# EAGLE design megacommand18 (EAGLE 7.3.0)

## Sheet 1 of 5
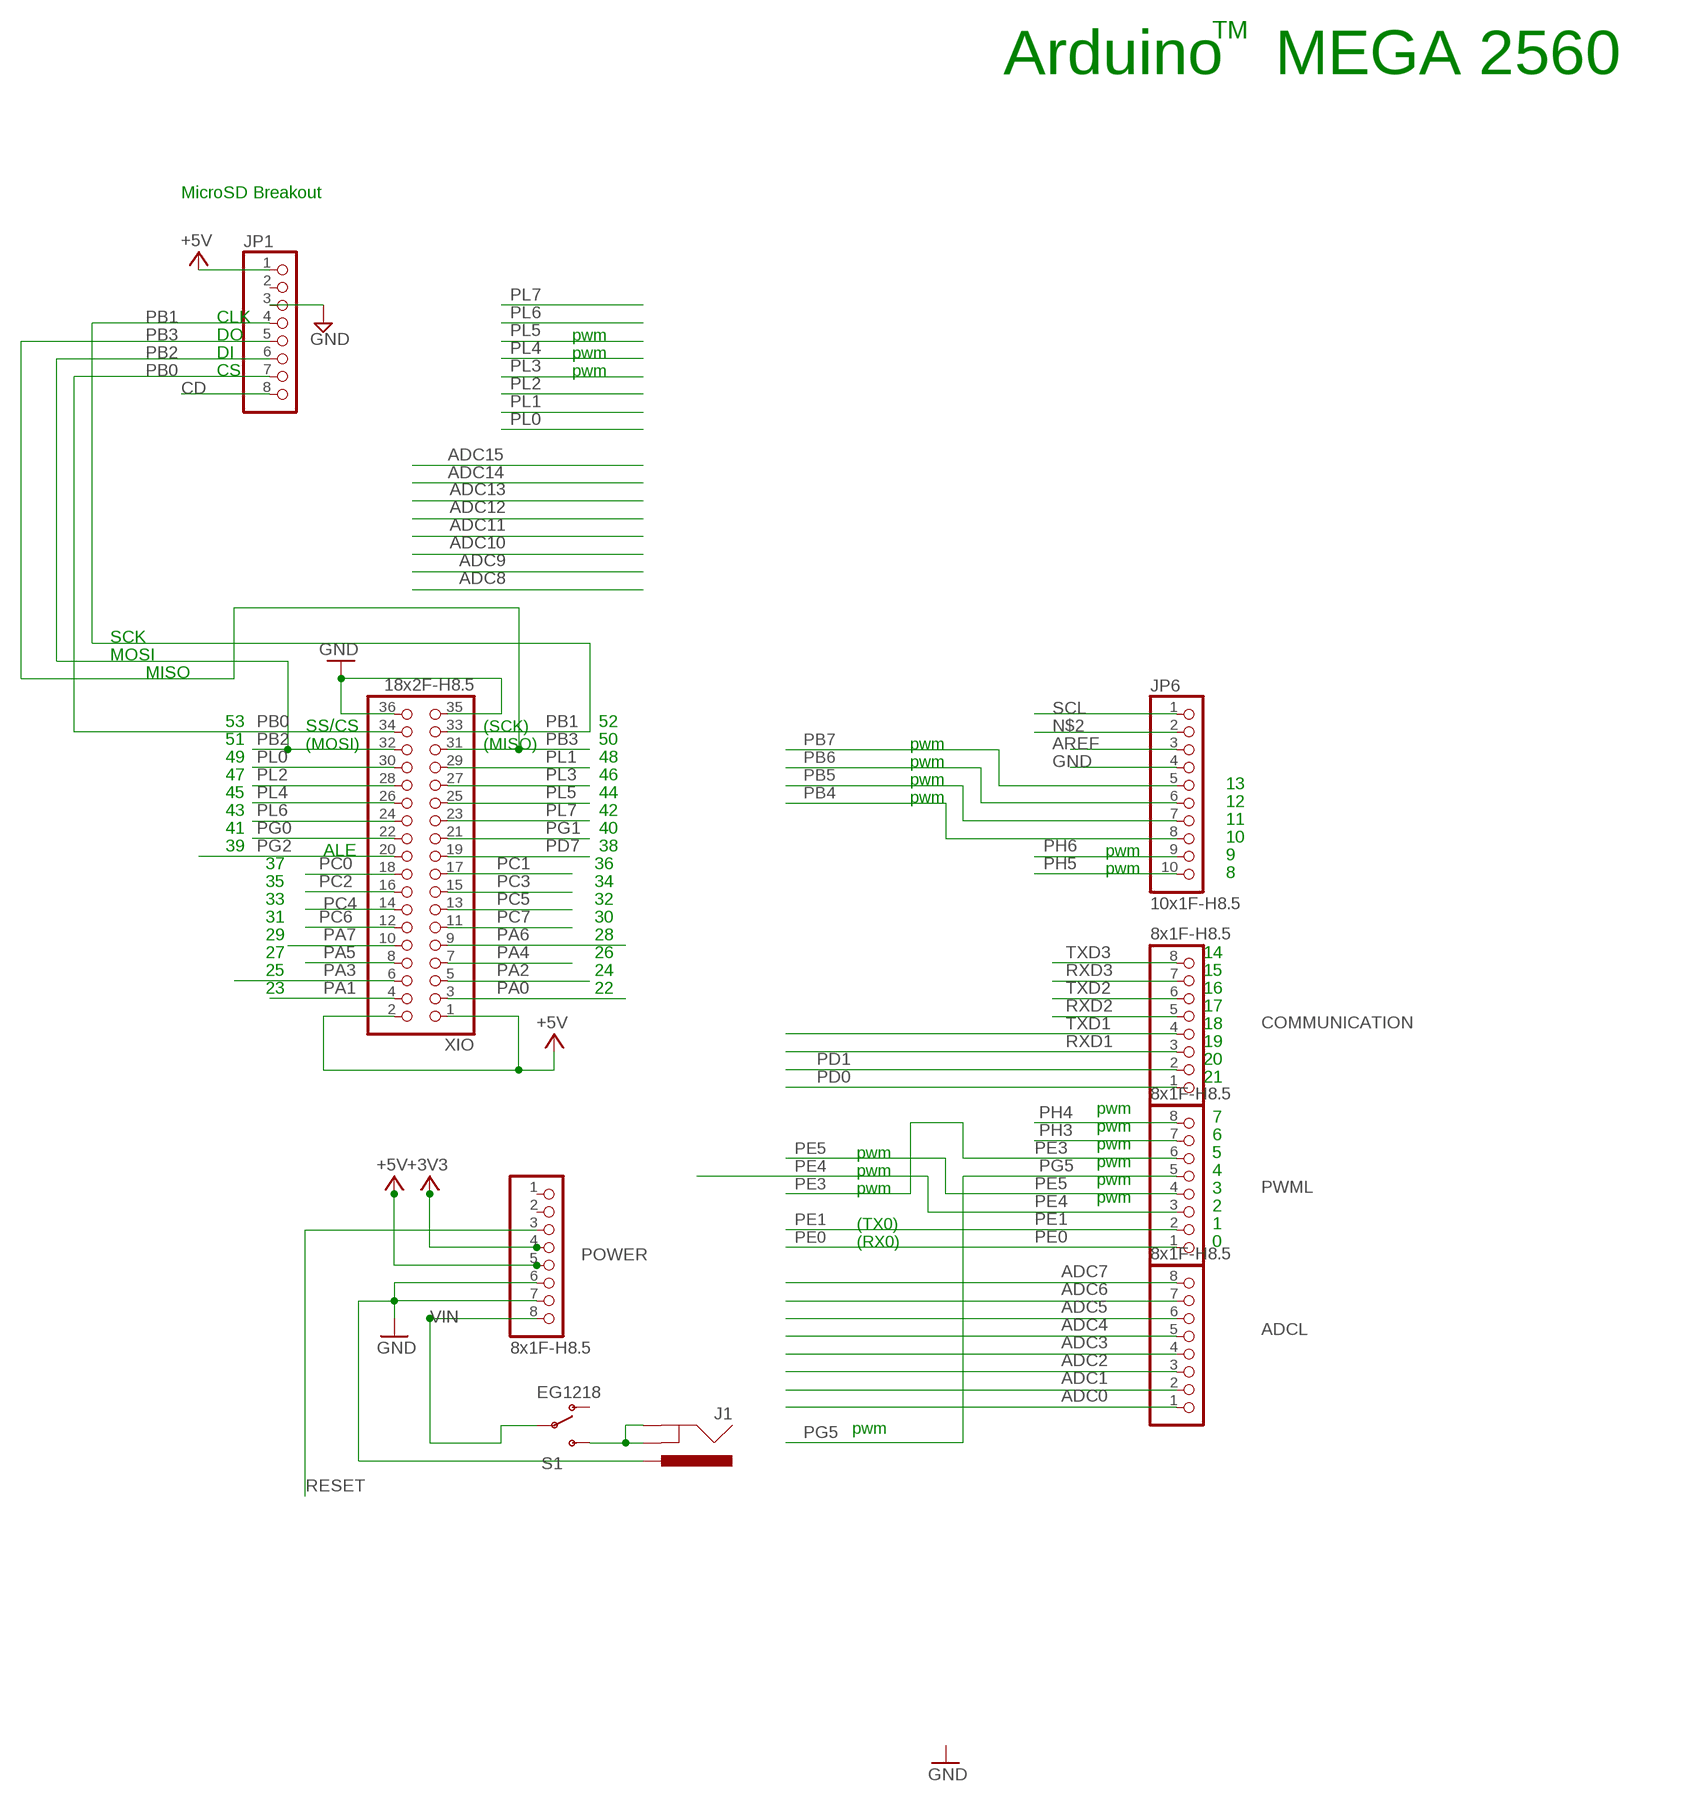
[diagram p0: schematic, sheet 1]

### Parts
ADCL  8x1F-H8.5  PINHD-1X8  [1X08]
COMMUNICATION  8x1F-H8.5  PINHD-1X8  [1X08]
J1  POWER_JACKSLT  [POWER_JACK_SLOT]
JP1  PINHD-1X8BIG  [1X08-BIG]
JP6  10x1F-H8.5  PINHD-1X10_ARD  [1X10]
POWER  8x1F-H8.5  PINHD-1X8  [1X08]
PWML  8x1F-H8.5  PINHD-1X8  [1X08]
S1  EG1218  SWITCH-SPDTKIT  [SWITCH-SPDT_KIT]
XIO  18x2F-H8.5  PINHD-2X18  [2X18]

### Nets
+3V3 [power]: POWER.4
+5V [power usb]: JP1.1 POWER.5 XIO.1 XIO.2 ; also sheet 2,3,4,5
ADC0: ADCL.1 ; also sheet 3
ADC1: ADCL.2 ; also sheet 3
ADC2: ADCL.3 ; also sheet 3
ADC3: ADCL.4 ; also sheet 3
ADC4: ADCL.5
ADC5: ADCL.6
ADC6: ADCL.7
ADC7: ADCL.8
AREF: JP6.3
CD: JP1.8
GND [gnd]: J1.PWR JP1.3 JP6.4 POWER.6 POWER.7 XIO.35 XIO.36 ; also sheet 2,3,4,5
N$2: JP6.2
N$23: J1.GND@1(GNDBREAK) J1.GND@2(GND) S1.3(S)
PA0: XIO.3 ; also sheet 4
PA1: XIO.4 ; also sheet 4
PA2: XIO.5 ; also sheet 4
PA3: XIO.6 ; also sheet 4
PA4: XIO.7 ; also sheet 4
PA5: XIO.8 ; also sheet 4
PA6: XIO.9 ; also sheet 4
PA7: XIO.10 ; also sheet 4
PB0: JP1.7 XIO.34
PB1: JP1.4 XIO.33
PB2: JP1.6 XIO.32
PB3: JP1.5 XIO.31
PB4: JP6.8
PB5: JP6.7
PB6: JP6.6
PB7: JP6.5
PC0: XIO.18 ; also sheet 4
PC1: XIO.17 ; also sheet 4
PC2: XIO.16 ; also sheet 4
PC3: XIO.15 ; also sheet 4
PC4: XIO.14 ; also sheet 4
PC5: XIO.13 ; also sheet 4
PC6: XIO.12 ; also sheet 4
PC7: XIO.11 ; also sheet 4
PD0: COMMUNICATION.1
PD1: COMMUNICATION.2
PD7: XIO.19
PE0: PWML.1
PE1: PWML.2
PE3: PWML.6
PE4: PWML.3 ; also sheet 3
PE5: PWML.4 ; also sheet 3
PG0: XIO.22 ; also sheet 4
PG1: XIO.21 ; also sheet 4
PG2: XIO.20 ; also sheet 4
PG5: PWML.5
PH3: PWML.7
PH4: PWML.8
PH5: JP6.10
PH6: JP6.9
PL0: XIO.30 ; also sheet 2
PL1: XIO.29 ; also sheet 2
PL2: XIO.28 ; also sheet 2
PL3: XIO.27 ; also sheet 3
PL4: XIO.26 ; also sheet 3
PL5: XIO.25
PL6: XIO.24 ; also sheet 4
PL7: XIO.23
RESET: POWER.3
RXD1: COMMUNICATION.3 ; also sheet 5
RXD2: COMMUNICATION.5 ; also sheet 5
RXD3: COMMUNICATION.7
SCL: JP6.1
TXD1: COMMUNICATION.4 ; also sheet 5
TXD2: COMMUNICATION.6 ; also sheet 5
TXD3: COMMUNICATION.8
VIN [power]: POWER.8 S1.2(P)
Unconnected: JP1.2 POWER.1 POWER.2 S1.1(O)

### Notes on the sheet
- TM
- Arduino   MEGA 2560
- MicroSD Breakout
- CLK
- DO | pwm
- DI | pwm
- CS | pwm
- SCK
- MOSI
- MISO
- 53 | SS/CS | (SCK) | 52
- 51 | (MOSI) | (MISO) | 50 | pwm
- 49 | 48 | pwm
- 47 | 46 | pwm
- 13
- 45 | 44 | pwm
- 12
- 43 | 42
- 11
- 41 | 40
- 10
- 39 | ALE | 38 | pwm
- 9
- 37 | 36 | pwm
- 8
- 35 | 34
- 33 | 32
- 31 | 30
- 29 | 28
- 27 | 26 | 14
- 25 | 24 | 15
- 23 | 22 | 16
- 17
- 18
- 19
- 20
- 21
- pwm
- 7
- pwm
- 6
- pwm
- pwm | 5
- pwm
- pwm | 4
- pwm
- pwm | 3
- pwm
- 2
- (TX0) | 1
- (RX0) | 0
- pwm

## Sheet 2 of 5
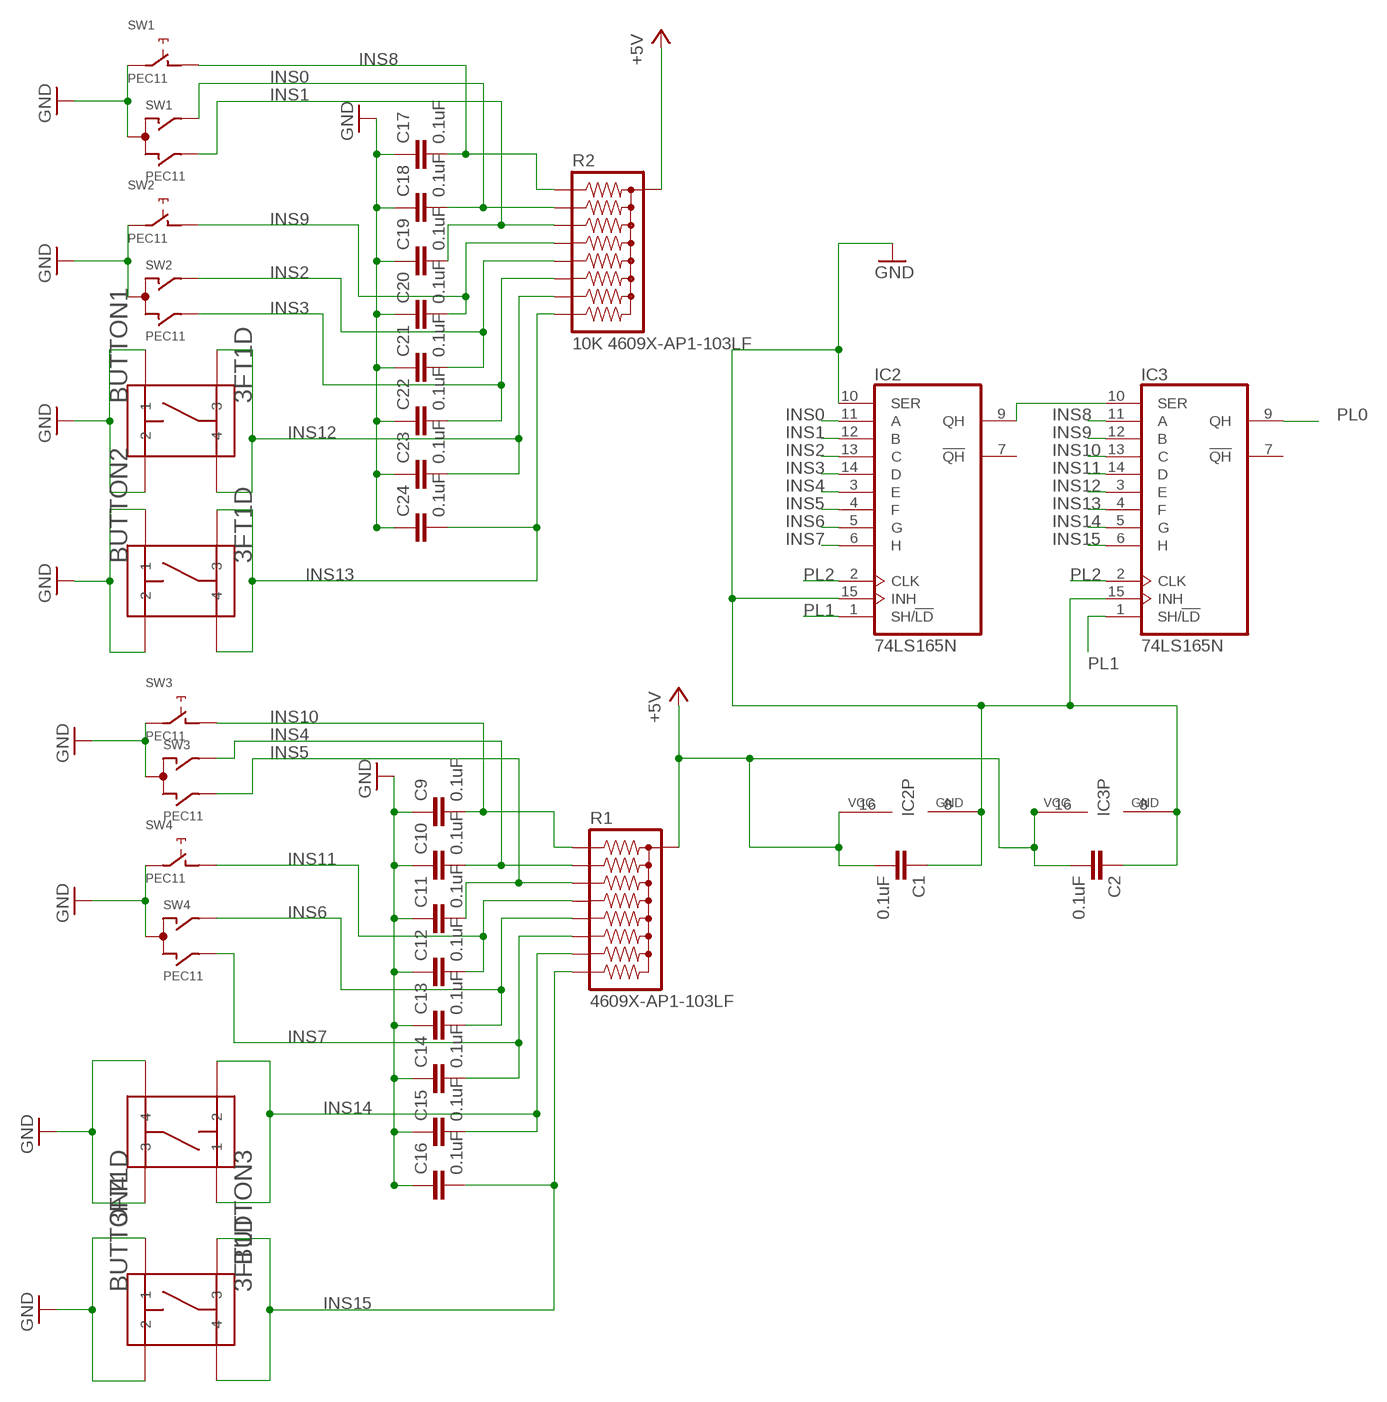
[diagram p1: schematic, sheet 2]

### Parts
BUTTON1  3FT1D  [3FT]
BUTTON2  3FT1D  [3FT]
BUTTON3  3FT1D  [3FT]
BUTTON4  3FT1D  [3FT]
C1  0.1uF  C-EU025-050X050  [C025-050X050]
C2  0.1uF  C-EU025-050X050  [C025-050X050]
C9  0.1uF  C-EU025-050X050  [C025-050X050]
C10  0.1uF  C-EU025-050X050  [C025-050X050]
C11  0.1uF  C-EU025-050X050  [C025-050X050]
C12  0.1uF  C-EU025-050X050  [C025-050X050]
C13  0.1uF  C-EU025-050X050  [C025-050X050]
C14  0.1uF  C-EU025-050X050  [C025-050X050]
C15  0.1uF  C-EU025-050X050  [C025-050X050]
C16  0.1uF  C-EU025-050X050  [C025-050X050]
C17  0.1uF  C-EU025-050X050  [C025-050X050]
C18  0.1uF  C-EU025-050X050  [C025-050X050]
C19  0.1uF  C-EU025-050X050  [C025-050X050]
C20  0.1uF  C-EU025-050X050  [C025-050X050]
C21  0.1uF  C-EU025-050X050  [C025-050X050]
C22  0.1uF  C-EU025-050X050  [C025-050X050]
C23  0.1uF  C-EU025-050X050  [C025-050X050]
C24  0.1uF  C-EU025-050X050  [C025-050X050]
IC2  74LS165N  [DIL16]
IC3  74LS165N  [DIL16]
R1  4609X-AP1-103LF  RPACK-BUSSED-8-SIP-PTH-8  [RPACK-SIP-PTH-8]
R2  10K 4609X-AP1-103LF  RPACK-BUSSED-8-SIP-PTH-8  [RPACK-SIP-PTH-8]
SW1  PEC11  EC12E_SW  [ALPS_EC12E_SW]
SW2  PEC11  EC12E_SW  [ALPS_EC12E_SW]
SW3  PEC11  EC12E_SW  [ALPS_EC12E_SW]
SW4  PEC11  EC12E_SW  [ALPS_EC12E_SW]

### Nets
+5V [power usb]: C1.2 C2.2 IC2.16(VCC) IC3.16(VCC) R1.P$1 R2.P$1 ; also sheet 1,3,4,5
GND [gnd]: BUTTON1.P$1 BUTTON1.P$2 BUTTON2.P$1 BUTTON2.P$2 BUTTON3.P$3 BUTTON3.P$4 BUTTON4.P$1 BUTTON4.P$2 C1.1 C2.1 C9.1 C10.1 C11.1 C12.1 C13.1 C14.1 C15.1 C16.1 C17.1 C18.1 C19.1 C20.1 C21.1 C22.1 C23.1 C24.1 IC2.8(GND) IC2.10(SER) IC2.15(INH) IC3.8(GND) IC3.15(INH) SW1.C SW1.E SW2.C SW2.E SW3.C SW3.E SW4.C SW4.E ; also sheet 1,3,4,5
INS0: C18.2 IC2.11(A) R2.P$3 SW1.A
INS1: C19.2 IC2.12(B) R2.P$4 SW1.B
INS2: C21.2 IC2.13(C) R2.P$6 SW2.A
INS3: C22.2 IC2.14(D) R2.P$7 SW2.B
INS4: C10.2 IC2.3(E) R1.P$3 SW3.A
INS5: C11.2 IC2.4(F) R1.P$4 SW3.B
INS6: C13.2 IC2.5(G) R1.P$6 SW4.A
INS7: C14.2 IC2.6(H) R1.P$7 SW4.B
INS8: C17.2 IC3.11(A) R2.P$2 SW1.D
INS9: C20.2 IC3.12(B) R2.P$5 SW2.D
INS10: C9.2 IC3.13(C) R1.P$2 SW3.D
INS11: C12.2 IC3.14(D) R1.P$5 SW4.D
INS12: BUTTON1.P$3 BUTTON1.P$4 C23.2 IC3.3(E) R2.P$8
INS13: BUTTON2.P$3 BUTTON2.P$4 C24.2 IC3.4(F) R2.P$9
INS14: BUTTON3.P$1 BUTTON3.P$2 C15.2 IC3.5(G) R1.P$8
INS15: BUTTON4.P$3 BUTTON4.P$4 C16.2 IC3.6(H) R1.P$9
N$12: IC2.9(QH) IC3.10(SER)
PL0: IC3.9(QH) ; also sheet 1
PL1: IC2.1(SH/!LD) IC3.1(SH/!LD) ; also sheet 1
PL2: IC2.2(CLK) IC3.2(CLK) ; also sheet 1
Unconnected: IC2.7(!QH) IC3.7(!QH) SW1.GND1(GND1:G) SW1.GND2(GND2:G) SW2.GND1(GND1:G) SW2.GND2(GND2:G) SW3.GND1(GND1:G) SW3.GND2(GND2:G) SW4.GND1(GND1:G) SW4.GND2(GND2:G)

## Sheet 3 of 5
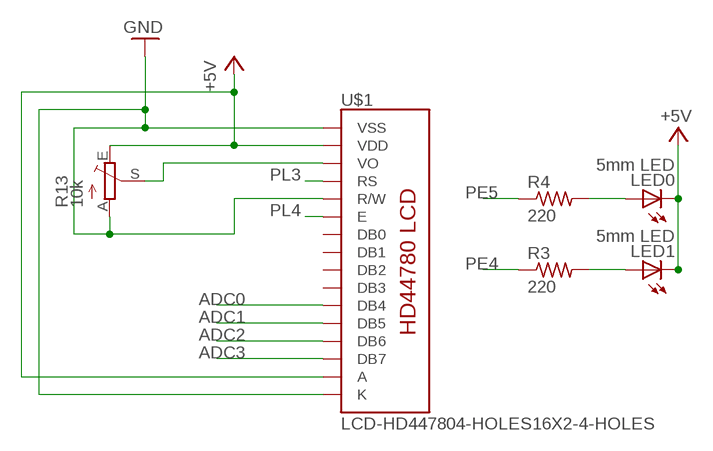
[diagram p2: schematic, sheet 3]

### Parts
LED0  5mm LED  LED_ELD260  [LED_LD260]
LED1  5mm LED  LED_ELD260  [LED_LD260]
R3  220  R-US_0207/7  [0207/7]
R4  220  R-US_0207/7  [0207/7]
R13  10k  TRIM_EU-CA6V  [CA6V]
U$1  LCD-HD447804-HOLES16X2-4-HOLES  [LCD-16X2-4HOLESRGB]

### Nets
+5V [power usb]: LED0.K(C) LED1.K(C) R13.E U$1.2(VDD) U$1.15(A) U$1.18(VDD) U$1.31(A) ; also sheet 1,2,4,5
ADC0: U$1.11(DB4) U$1.27(DB4) ; also sheet 1
ADC1: U$1.12(DB5) U$1.28(DB5) ; also sheet 1
ADC2: U$1.13(DB6) U$1.29(DB6) ; also sheet 1
ADC3: U$1.14(DB7) U$1.30(DB7) ; also sheet 1
GND [gnd]: R13.A U$1.1(VSS) U$1.5(R/W) U$1.16(K) U$1.17(VSS) U$1.21(R/W) U$1.32(K) ; also sheet 1,2,4,5
N$3: LED0.A R4.2
N$13: LED1.A R3.2
N$27: R13.S U$1.3(VO) U$1.19(VO)
PE4: R3.1 ; also sheet 1
PE5: R4.1 ; also sheet 1
PL3: U$1.4(RS) U$1.20(RS) ; also sheet 1
PL4: U$1.6(E) U$1.22(E) ; also sheet 1
Unconnected: U$1.7(DB0) U$1.8(DB1) U$1.9(DB2) U$1.10(DB3) U$1.23(DB0) U$1.24(DB1) U$1.25(DB2) U$1.26(DB3)

## Sheet 4 of 5
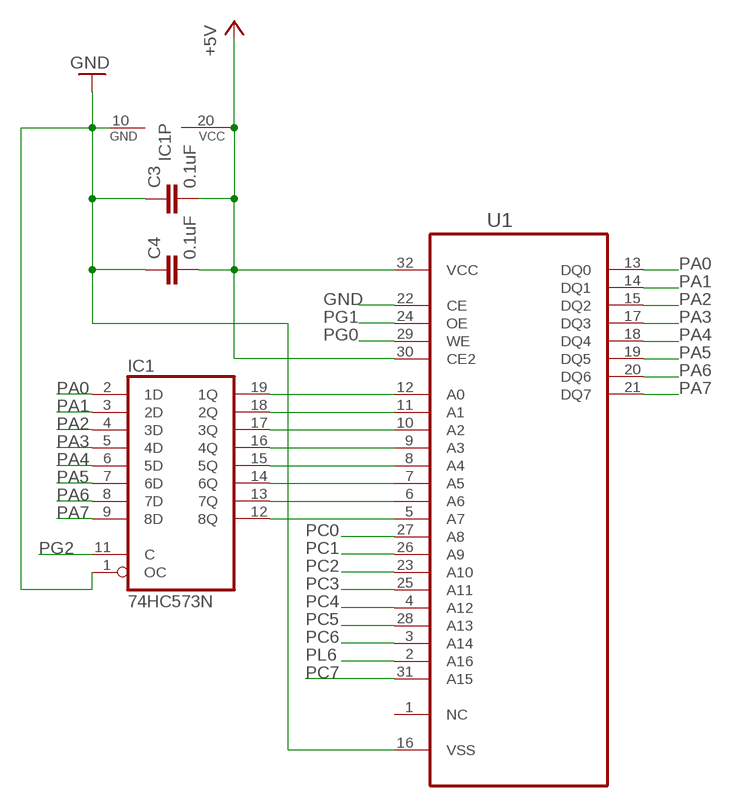
[diagram p3: schematic, sheet 4]

### Parts
C3  0.1uF  C-EU025-050X050  [C025-050X050]
C4  0.1uF  C-EU025-050X050  [C025-050X050]
IC1  74HC573N  [DIL20]
U1  AS6C1008-55PCN  [DIP254P1524X393-32]

### Nets
+5V [power usb]: C3.2 C4.2 IC1.20(VCC) U1.30(CE2) U1.32(VCC) ; also sheet 1,2,3,5
GND [gnd]: C3.1 C4.1 IC1.1(OC) IC1.10(GND) U1.16(VSS) U1.22(CE) ; also sheet 1,2,3,5
N$4: IC1.13(7Q) U1.6(A6)
N$5: IC1.19(1Q) U1.12(A0)
N$6: IC1.18(2Q) U1.11(A1)
N$7: IC1.17(3Q) U1.10(A2)
N$8: IC1.16(4Q) U1.9(A3)
N$9: IC1.15(5Q) U1.8(A4)
N$10: IC1.14(6Q) U1.7(A5)
N$11: IC1.12(8Q) U1.5(A7)
PA0: IC1.2(1D) U1.13(DQ0) ; also sheet 1
PA1: IC1.3(2D) U1.14(DQ1) ; also sheet 1
PA2: IC1.4(3D) U1.15(DQ2) ; also sheet 1
PA3: IC1.5(4D) U1.17(DQ3) ; also sheet 1
PA4: IC1.6(5D) U1.18(DQ4) ; also sheet 1
PA5: IC1.7(6D) U1.19(DQ5) ; also sheet 1
PA6: IC1.8(7D) U1.20(DQ6) ; also sheet 1
PA7: IC1.9(8D) U1.21(DQ7) ; also sheet 1
PC0: U1.27(A8) ; also sheet 1
PC1: U1.26(A9) ; also sheet 1
PC2: U1.23(A10) ; also sheet 1
PC3: U1.25(A11) ; also sheet 1
PC4: U1.4(A12) ; also sheet 1
PC5: U1.28(A13) ; also sheet 1
PC6: U1.3(A14) ; also sheet 1
PC7: U1.31(A15) ; also sheet 1
PG0: U1.29(WE) ; also sheet 1
PG1: U1.24(OE) ; also sheet 1
PG2: IC1.11(C) ; also sheet 1
PL6: U1.2(A16) ; also sheet 1
Unconnected: U1.1(NC)

## Sheet 5 of 5
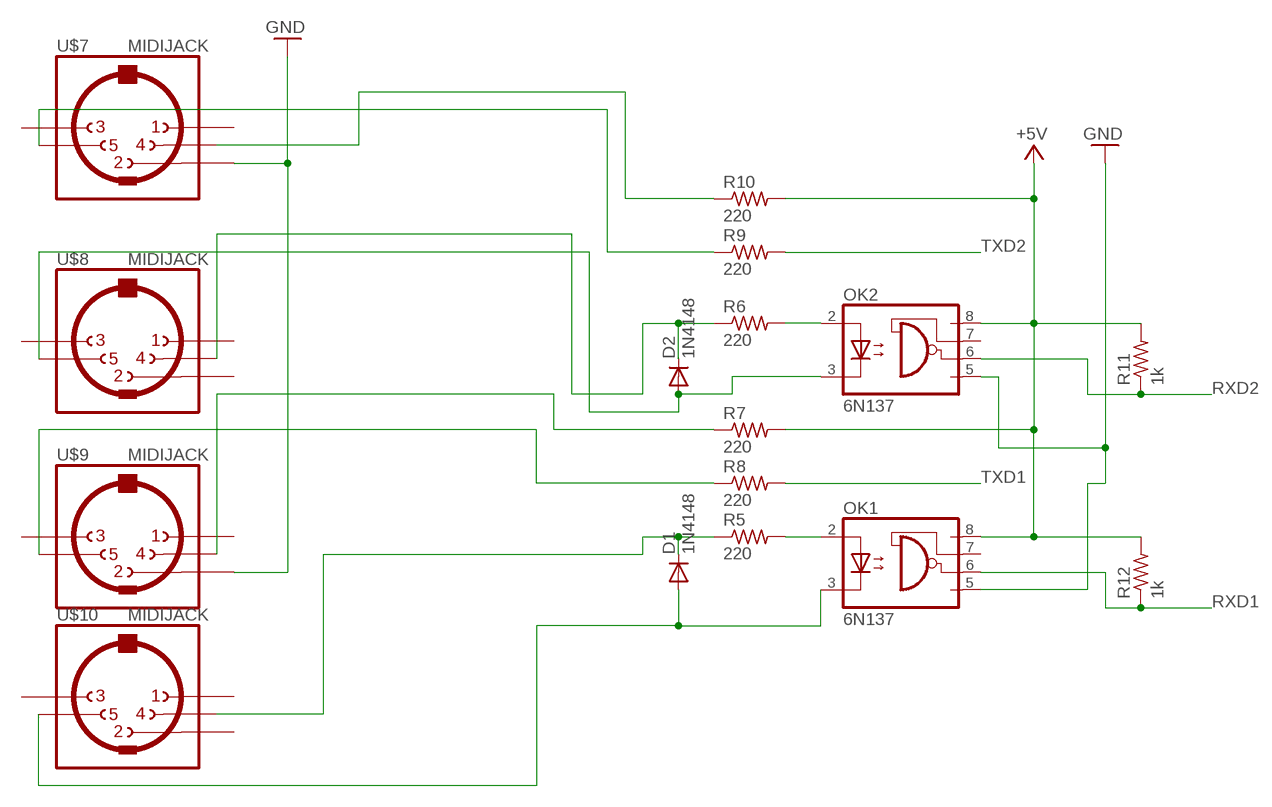
[diagram p4: schematic, sheet 5]

### Parts
D1  1N4148  1N4148DO35-7  [DO35-7]
D2  1N4148  1N4148DO35-7  [DO35-7]
OK1  6N137  [DIL08]
OK2  6N137  [DIL08]
R5  220  R-US_0207/7  [0207/7]
R6  220  R-US_0207/7  [0207/7]
R7  220  R-US_0207/7  [0207/7]
R8  220  R-US_0207/7  [0207/7]
R9  220  R-US_0207/7  [0207/7]
R10  220  R-US_0207/7  [0207/7]
R11  1k  R-US_0207/7  [0207/7]
R12  1k  R-US_0207/7  [0207/7]
U$7  MIDIJACK  [CP-2350]
U$8  MIDIJACK  [CP-2350]
U$9  MIDIJACK  [CP-2350]
U$10  MIDIJACK  [CP-2350]

### Nets
+5V [power usb]: OK1.8(VCC) OK2.8(VCC) R7.2 R10.2 R11.2 R12.2 ; also sheet 1,2,3,4
GND [gnd]: OK1.5(GND) OK2.5(GND) U$7.2 U$9.2 ; also sheet 1,2,3,4
N$1: R8.1 U$9.5
N$14: D1.A OK1.3(C) U$10.5
N$15: D1.C R5.1 U$10.4
N$16: R7.1 U$9.4
N$17: R10.1 U$7.4
N$18: OK2.2(A) R6.2
N$19: D2.A OK2.3(C) U$8.5
N$21: D2.C R6.1 U$8.4
N$22: R9.1 U$7.5
N$26: OK1.2(A) R5.2
RXD1: OK1.6(VO) R12.1 ; also sheet 1
RXD2: OK2.6(VO) R11.1 ; also sheet 1
TXD1: R8.2 ; also sheet 1
TXD2: R9.2 ; also sheet 1
Unconnected: OK1.7(VE) OK2.7(VE) U$7.1 U$7.3 U$8.1 U$8.2 U$8.3 U$9.1 U$9.3 U$10.1 U$10.2 U$10.3

## Library data of the parts
ADCL COMMUNICATION POWER PWML = SmartPrj:PINHD-1X8: PIN HEADER
BUTTON1-BUTTON4 = mec switches:3FT1D: Mulitmec - 3FT1D <http://www.mec.dk/statisk.php4?id=504> Switch 3F - Through Hole with basic matt cover http://www.mec.dk
C1-C4 C9-C24 = rcl:C-EU: CAPACITOR, European symbol
D1 D2 = diode:1N4148: DIODE high speed (Philips)
IC1 = 74xx-us:74*573: 8-bit D latch BUS DRIVER
IC2 IC3 = 74xx-us:74*165: 8-bit parallel load SHIFT REGISTER
J1 = SparkFun-Connectors:POWER_JACK: Power Jack This is the standard 5.5mm barrel jack for power. The PTH is the most common, proven, reliable, footprint. The Slot footprint only works if the mill layer is transmitted to the PCB fab house so be warned. Mating wall wart : TOL-00298 (and others); PROD_ID: PRT-00119
JP1 = adafruit:PINHD-1X8: PIN HEADER
JP6 = SmartPrj:PINHD-1X10_ARD: PIN HEADER
LED0 LED1 = eagle-ltspice:LED_E: LED Source: http://www.osram.convergy.de Source: www.luxeon.com Source: www.kingbright.com; SPICEMODEL: NONE; SPICEPREFIX: D; SPICETYPE: diode
OK1 OK2 = optocoupler:6N137: MOTOROLA OPTO COUPLER; MPN: 6N137; OC_FARNELL: 1328376; OC_NEWARK: 52M1895
R1 R2 = SparkFun-Resistors:RPACK-BUSSED-8: BOURNS 4600X/R series thick-film SIP resistor packs Height resistors bussed to a single pin (denoted by dot). datasheet <http://dlnmh9ip6v2uc.cloudfront.net/datasheets/Components/General/4600x.pdf> SIMILAR TO: SFE parts COM-10855 (330), COM-10856 (10K)
R3-R12 = resistor:R-US_: RESISTOR, American symbol
R13 = pot:TRIM_EU-: POTENTIOMETER
S1 = SparkFun-Electromechanical:SWITCH-SPDT: SPDT Switch Simple slide switch, Spark Fun Electronics SKU : COM-00102 DPDT SMT slide switch, AYZ0202, SWCH-08179; PROD_ID: SWCH-08261
SW1-SW4 = pec11:EC12E_SW: ALPS rotary Encoder EC12E series with switch; MPN: EC12E2424407; OC_FARNELL: 1520813; OC_NEWARK: 74M1068
U1 = Alliance_Memory_By_element14_Batch_1:AS6C1008-55PCN: CMOS SRAM; MPN: AS6C1008-55PCN; OC_FARNELL: 1562896; OC_NEWARK: 94M6214; PACKAGE: DIP-32; SUPPLIER: ALLIANCE MEMORY
U$1 = HD44780LCD:LCD-HD44780
U$7-U$10 = adafruit_din:MIDIJACK: DIN 5 jack also known as MIDI jack A modification of conn-hirshman:MAB5SH with two options for the grounding 'teeth'
XIO = SmartPrj:PINHD-2X18: PIN HEADER

## Net classes
0 default: width 0.203 mm, drill 0.406 mm, clearance 0.203 mm
1 power: width 0.61 mm, drill 0.406 mm, clearance 0.203 mm
2 gnd: width 0.305 mm, drill 0.406 mm, clearance 0.203 mm
3 power usb: width 0.508 mm, drill 0.406 mm, clearance 0.203 mm

## Board
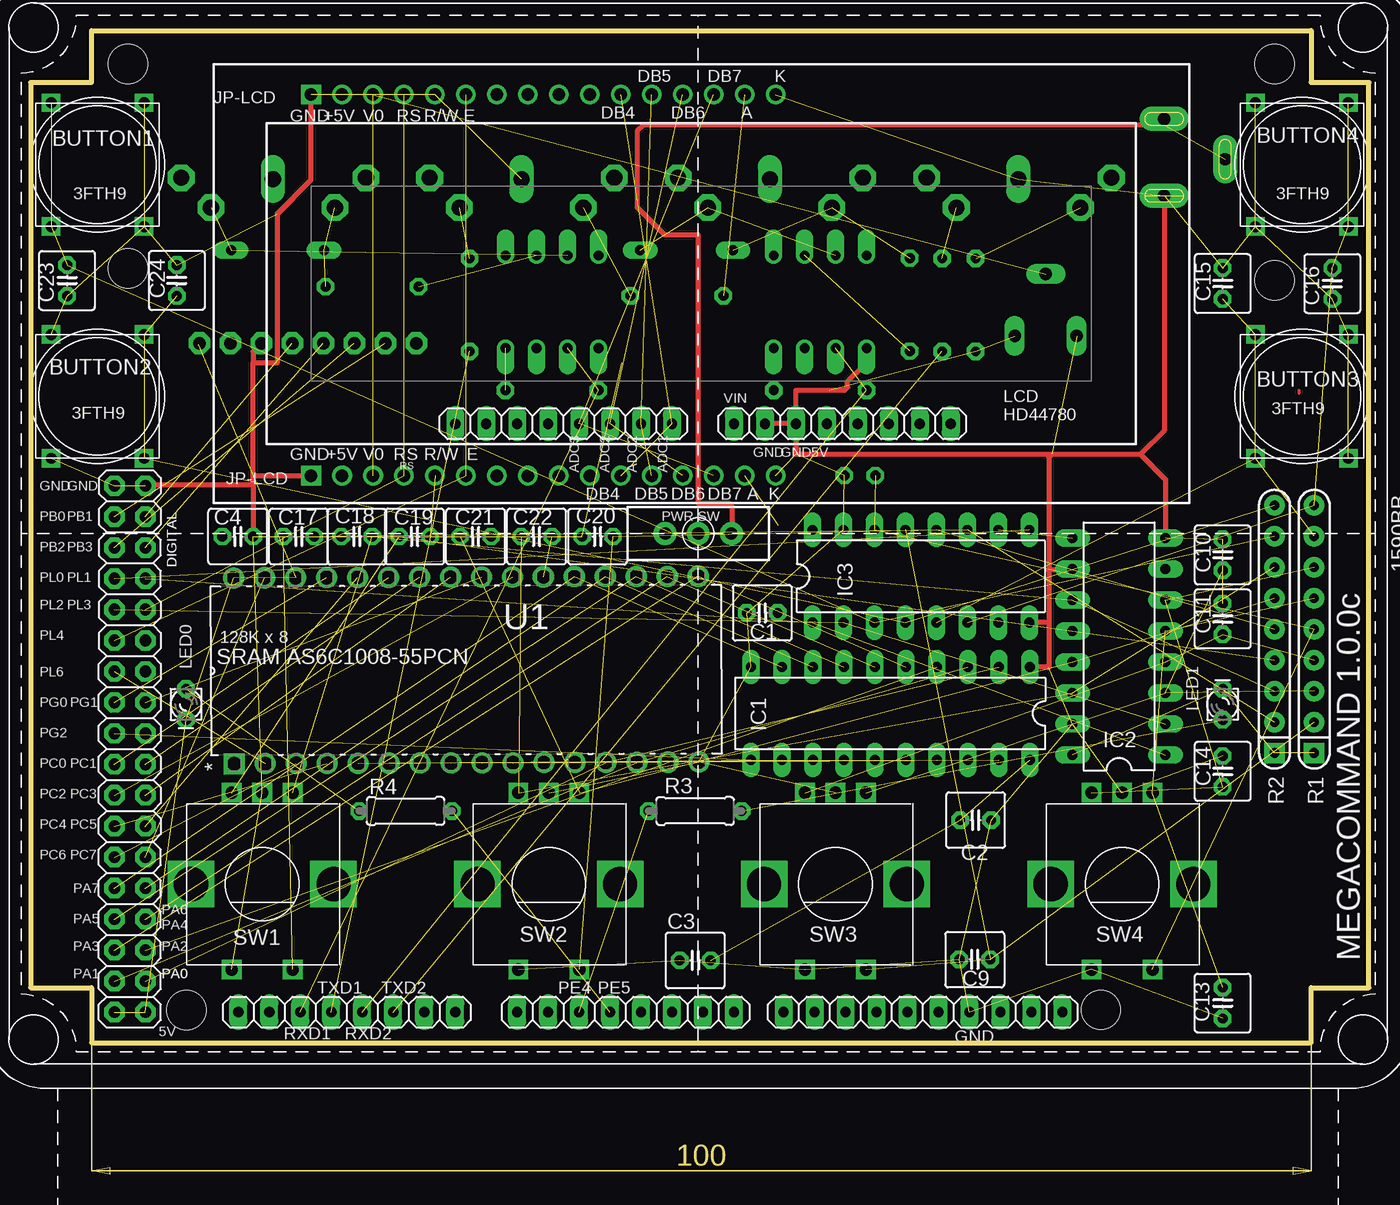
[diagram p5: board, top side]
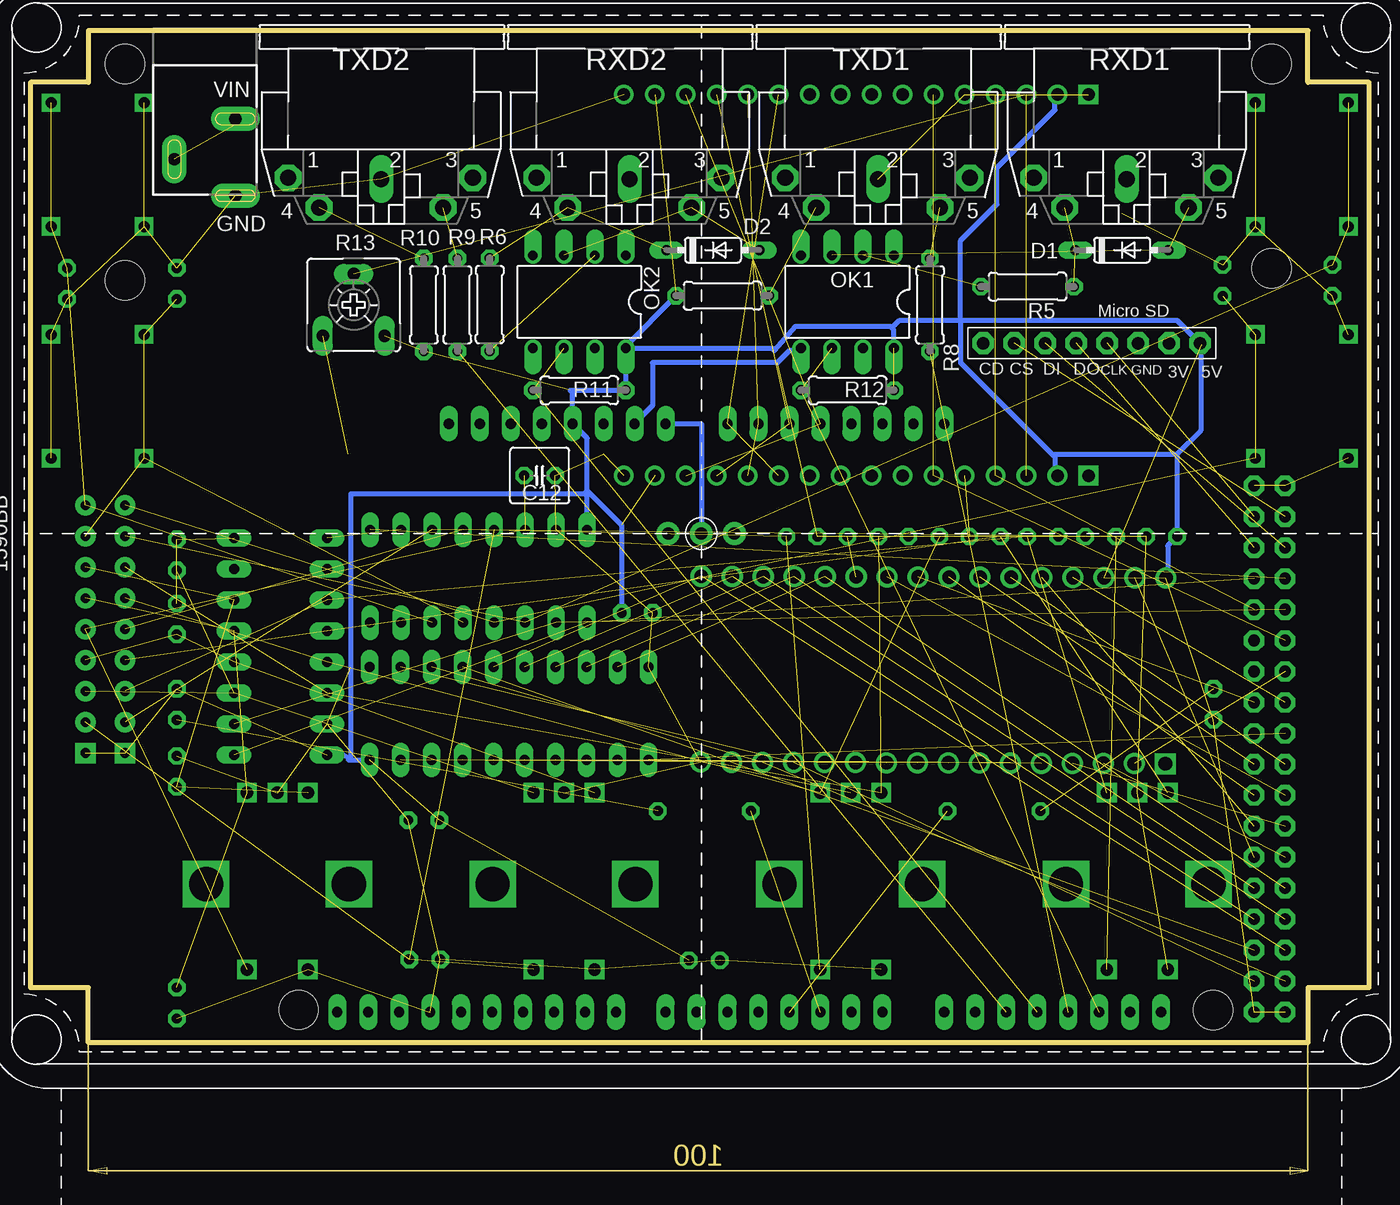
[diagram p6: board, bottom side, seen from below]

Size 109.75 x 83 mm. Coordinates in mm from the lower left corner, seen from the top.
Outline: 0,78.75 0,4.5 5,4.5 5,0 105,0 105,4.5 109.75,4.5 109.75,78.75 105,78.75 105,83 5,83 5,78.75 0,78.75
Copper layers (1*16): Top 0.035mm / dielectric 1.5mm / Bottom 0.035mm
Design rules "SparkFun": minimum track width 8mil, minimum drill 20mil, track to track 8mil, track to pad 8mil, pad to pad 8mil, via to via 8mil, smd to smd 8mil, copper to edge 10mil, drill to drill 8mil, minimum pad ring 12mil, minimum via ring 10mil, stop-mask expansion 4mil, vias tented up to drill 25mil, thermal gap 10mil
Holes 3.2 mm at 87.77,2.7 12.79,2.67 8,63.5 102,62.5 8,80.25 102,80.25

### Footprints (pad centres in the part's own frame; a part is rotated, then mirrored left to right if it is on the bottom)
1X08 = drill 0.85 pad 1.422 long: 1 -8.89,0; 2 -6.35,0; 3 -3.81,0; 4 -1.27,0; 5 1.27,0; 6 3.81,0; 7 6.35,0; 8 8.89,0
3FT = drill 0.9 square: P$1 5.08,3.81; P$2 -5.08,3.81; P$3 5.08,-3.81; P$4 -5.08,-3.81
C025-050X050 = drill 0.813 octagon: 1 -1.27,0; 2 1.27,0
DO35-7 = drill 0.813 long: A 3.81,0; C -3.81,0
DIL20 = drill 0.813 long: 1 -11.43,-3.81; 2 -8.89,-3.81; 3 -6.35,-3.81; 4 -3.81,-3.81; 5 -1.27,-3.81; 6 1.27,-3.81; 7 3.81,-3.81; 8 6.35,-3.81; 9 8.89,-3.81; 10 11.43,-3.81; 11 11.43,3.81; 12 8.89,3.81; 13 6.35,3.81; 14 3.81,3.81; 15 1.27,3.81; 16 -1.27,3.81; 17 -3.81,3.81; 18 -6.35,3.81; 19 -8.89,3.81; 20 -11.43,3.81
DIL16 = drill 0.813 long: 1 -8.89,-3.81; 2 -6.35,-3.81; 3 -3.81,-3.81; 4 -1.27,-3.81; 5 1.27,-3.81; 6 3.81,-3.81; 7 6.35,-3.81; 8 8.89,-3.81; 9 8.89,3.81; 10 6.35,3.81; 11 3.81,3.81; 12 1.27,3.81; 13 -1.27,3.81; 14 -3.81,3.81; 15 -6.35,3.81; 16 -8.89,3.81
POWER_JACK_SLOT = drill 1 pad 2 long: GND@1 2.58,7.5; GND@2 7.58,10.8; PWR 2.58,13.8
1X08-BIG = drill 1.016 pad 1.778 octagon: 1 -8.89,0; 2 -6.35,0; 3 -3.81,0; 4 -1.27,0; 5 1.27,0; 6 3.81,0; 7 6.35,0; 8 8.89,0
1X10 = drill 0.85 pad 1.422 long: 1 -11.43,0; 2 -8.89,0; 3 -6.35,0; 4 -3.81,0; 5 -1.27,0; 6 1.27,0; 7 3.81,0; 8 6.35,0; 9 8.89,0; 10 11.43,0
LED_LD260 = drill 0.813 octagon: A -1.27,0; K 1.27,0
DIL08 = drill 0.813 offset: 1 -3.81,-3.81; 2 -1.27,-3.81; 3 1.27,-3.81; 4 3.81,-3.81; 5 3.81,3.81; 6 1.27,3.81; 7 -1.27,3.81; 8 -3.81,3.81
RPACK-SIP-PTH-8 = drill 0.8 pad 1.676 square: P$1 0,0 | drill 0.8 pad 1.676: P$2 0,-2.54; P$3 0,-5.08; P$4 0,-7.62; P$5 0,-10.16; P$6 0,-12.7; P$7 0,-15.24; P$8 0,-17.78; P$9 0,-20.32
0207/7 = drill 0.813 octagon: 1 -3.81,0; 2 3.81,0
CA6V = drill 1.016 long: A -2.54,-2.54; E 2.54,-2.54; S 0,2.54
SWITCH-SPDT_KIT = drill 1.016 pad 1.88: 1 0,2.718; 2 0,0; 3 0,-2.718
ALPS_EC12E_SW = drill 1 square: A -2.5,-7.5; B 2.5,-7.5; C 0,-7.5; D -2.5,7; E 2.5,7 | drill 2.8 square: GND1 -5.85,0; GND2 5.85,0
DIP254P1524X393-32 = drill 1.118 square: 1 -15.24,38.1 | drill 1.118: 2 -15.24,35.56; 3 -15.24,33.02; 4 -15.24,30.48; 5 -15.24,27.94; 6 -15.24,25.4; 7 -15.24,22.86; 8 -15.24,20.32; 9 -15.24,17.78; 10 -15.24,15.24; 11 -15.24,12.7; 12 -15.24,10.16; 13 -15.24,7.62; 14 -15.24,5.08; 15 -15.24,2.54; 16 -15.24,0; 17 0,0; 18 0,2.54; 19 0,5.08; 20 0,7.62; 21 0,10.16; 22 0,12.7; 23 0,15.24; 24 0,17.78; 25 0,20.32; 26 0,22.86; 27 0,25.4; 28 0,27.94; 29 0,30.48; 30 0,33.02; 31 0,35.56; 32 0,38.1
LCD-16X2-4HOLESRGB = drill 1.016 square: 1 -32,15.5; 17 -32,-15.75 | drill 1.016: 2 -29.46,15.5; 3 -26.92,15.5; 4 -24.38,15.5; 5 -21.84,15.5; 6 -19.3,15.5; 7 -16.76,15.5; 8 -14.22,15.5; 9 -11.68,15.5; 10 -9.14,15.5; 11 -6.6,15.5; 12 -4.06,15.5; 13 -1.52,15.5; 14 1.02,15.5; 15 3.56,15.5; 16 6.1,15.5; 18 -29.46,-15.75; 19 -26.92,-15.75; 20 -24.38,-15.75; 21 -21.84,-15.75; 22 -19.3,-15.75; 23 -16.76,-15.75; 24 -14.22,-15.75; 25 -11.68,-15.75; 26 -9.14,-15.75; 27 -6.6,-15.75; 28 -4.06,-15.75; 29 -1.52,-15.75; 30 1.02,-15.75; 31 3.56,-15.75; 32 6.1,-15.75
CP-2350 = drill 1.321 pad 2.184 octagon: 1 7.62,12.58; 3 -7.52,12.58; 4 5.08,15.02; 5 -5.08,15.02 | drill 1.321 long: 2 0,12.68
2X18 = drill 0.95 pad 1.676 octagon: 1 -21.59,-1.27; 2 -21.59,1.27; 3 -19.05,-1.27; 4 -19.05,1.27; 5 -16.51,-1.27; 6 -16.51,1.27; 7 -13.97,-1.27; 8 -13.97,1.27; 9 -11.43,-1.27; 10 -11.43,1.27; 11 -8.89,-1.27; 12 -8.89,1.27; 13 -6.35,-1.27; 14 -6.35,1.27; 15 -3.81,-1.27; 16 -3.81,1.27; 17 -1.27,-1.27; 18 -1.27,1.27; 19 1.27,-1.27; 20 1.27,1.27; 21 3.81,-1.27; 22 3.81,1.27; 23 6.35,-1.27; 24 6.35,1.27; 25 8.89,-1.27; 26 8.89,1.27; 27 11.43,-1.27; 28 11.43,1.27; 29 13.97,-1.27; 30 13.97,1.27; 31 16.51,-1.27; 32 16.51,1.27; 33 19.05,-1.27; 34 19.05,1.27; 35 21.59,-1.27; 36 21.59,1.27

### Placement (x,y rotation side)
ADCL  43.71,50.76 180 top
BUTTON1  5.5,72 270 top
BUTTON2  5.5,53 90 top
BUTTON3  104.25,53 90 top
BUTTON4  104.25,72 90 top
C1  60,35.25 0 top
C2  77.5,18.25 180 top
C3  54.5,6.75 0 top
C4  17,41.5 180 top
C9  77.42,6.82 0 top
C10  97.75,40 270 top
C11  97.75,34.75 270 top
C12  68,46.5 180 bottom
C13  97.75,3.25 90 top
C14  97.75,22.25 270 top
C15  97.75,62.25 270 top
C16  106.75,62.25 90 top
C17  22,41.5 180 top
C18  26.75,41.5 0 top
C19  31.5,41.5 180 top
C20  46.5,41.5 0 top
C21  36.5,41.5 180 top
C22  41.5,41.5 180 top
C23  3,62.5 90 top
C24  12,62.5 270 top
COMMUNICATION  25.93,2.5 0 top
D1  20.25,65 0 bottom
D2  53.79,65 0 bottom
IC1  70.5,27 180 top
IC2  89.25,32.5 90 top
IC3  73,38.25 0 top
J1  90.38,83.25 180 bottom
JP1  22.74,57.36 180 bottom
JP6  73.17,2.5 180 top
LED0  12.75,27.75 270 top
LED1  97.75,27.75 90 top
OK1  42.75,60.75 180 bottom
OK2  64.75,60.75 180 bottom
POWER  66.57,50.76 180 top
PWML  48.79,2.5 0 top
R1  105.25,23.75 180 top
R2  102,23.75 180 top
R3  54.5,19 0 top
R4  30.75,19 180 top
R5  28,62 180 bottom
R6  72.09,60.52 270 bottom
R7  53,61.25 180 bottom
R8  36,60.5 270 bottom
R9  74.75,60.5 270 bottom
R10  77.5,60.5 270 bottom
R11  64.75,53.5 0 bottom
R12  42.75,53.5 0 bottom
R13  83.25,60.5 0 bottom
S1  54.75,41.75 90 top
SW1  19,13 180 top
SW2  42.5,13 180 top
SW3  66,13 180 top
SW4  89.5,13 180 top
U1  54.75,38.25 90.2 top
U$1  55,62.25 0 top
U$7  81,83.5 180 bottom
U$8  60.62,83.5 180 bottom
U$9  40.25,83.5 180 bottom
U$10  19.88,83.5 180 bottom
U$14  [1590BB]  54.75,41.75 90 top
XIO  8.15,24.09 90 top

### Tracks (layer width: path | path; a pad name or v marks a point on that pad's centre or on a via)
+5V  (15 unrouted)
  Bottom 0.406: OK2.8 R11.2 65.5,53.5 65.3,53.3 POWER.5 64.11,49.57 64.11,45.27 | OK2.8 48.94,56.94 48.75,56.75 47,58.75 39.25,58.75 39.12,58.62 | 39.12,58.62 39,58.5 39,57 OK1.8 | OK2.8 60.94,57.12 R7.2 | IC3.16 64.11,45.27 | 33.5,59.25 38.5,59.25 39.12,58.62 | 33.5,59.25 15.75,59.25 14,57.5 JP1.1 | 25.88,48.12 33.5,55.75 33.5,59.25 | 25.88,48.12 25.75,48 25.75,46.5 U$1.18 | 15.75,48.25 25.75,48.25 25.88,48.12 | 15.75,48.25 15.75,41.5 | 15.75,41.5 16.5,40.75 16.5,38.25 U1.32 | 15.75,41.5 C4.2 | 33.5,59.25 33.5,65.75 30.5,68.75 30.5,71.75 25.75,76.5 25.75,77.75 U$1.2 | 64.11,45.27 61.27,42.43 C1.2 | 64.11,45.27 64.38,45 83.5,45 83.5,23.25 | 83.5,23.25 83.69,23.19 IC1.20 | 83.5,23.25 84.11,23.61 IC2.16 | 15.75,48.25 13.75,50.25 13.75,57.25
ADC0  (2 unrouted)
ADC1  (2 unrouted)
ADC2  (2 unrouted)
ADC3  (2 unrouted)
GND  (50 unrouted)
  Top 0.406: POWER.6 62.76,48.26 62.75,48.25 83.75,48.25 | 83.75,48.25 91,48.25 | 91,48.25 93,50.25 93,69.41 J1.PWR | POWER.6 POWER.7 | POWER.6 62.76,53.49 62.75,53.5 66.75,53.5 67,53.75 67,54.25 68.25,55.5 68.25,56.63 OK2.5 | XIO.35 9.49,45.75 18.25,45.75 | C4.1 18.27,45.73 18.25,45.75 | 18.25,46.5 18.25,55.75 | U$1.1 23,70.75 20.25,68 20.25,55.75 18.25,55.75 | JP1.3 18.25,56.68 18.25,55.75 | 18.25,45.75 18.25,46.5 | 18.25,46.5 U$1.17 | 83.75,48.25 83.5,48 83.5,38.75 | 83.5,38.75 83.5,34.5 | 83.5,34.5 83.5,30.75 83.44,30.81 IC1.1 | IC3.8 81.95,34.5 83.5,34.5 | IC2.10 85.34,38.75 83.5,38.75 | 91,48.25 93.06,46.19 IC2.8
  Bottom 0.406: OK1.5 46.56,56.81 46.5,56.75 47.5,56.75 48.5,55.75 58.75,55.75 58.75,52.23 POWER.7
INS0  (3 unrouted)
INS1  (3 unrouted)
INS2  (3 unrouted)
INS3  (3 unrouted)
INS4  (3 unrouted)
INS5  (3 unrouted)
INS6  (3 unrouted)
INS7  (3 unrouted)
INS8  (3 unrouted)
INS9  (3 unrouted)
INS10  (3 unrouted)
INS11  (3 unrouted)
INS12  (4 unrouted)
INS13  (4 unrouted)
INS14  (4 unrouted)
INS15  (4 unrouted)
N$1  (1 unrouted)
N$3  (1 unrouted)
N$4  (1 unrouted)
N$5  (1 unrouted)
N$6  (1 unrouted)
N$7  (1 unrouted)
N$8  (1 unrouted)
N$9  (1 unrouted)
N$10  (1 unrouted)
N$11  (1 unrouted)
N$12  (1 unrouted)
N$13  (1 unrouted)
N$14  (2 unrouted)
N$15  (2 unrouted)
N$16  (1 unrouted)
N$17  (1 unrouted)
N$18  (1 unrouted)
N$19  (2 unrouted)
N$20
  Top 0.254: 104,53.5 104,53.25
N$21  (2 unrouted)
N$22  (1 unrouted)
N$23  (1 unrouted)
  Top 0.406: J1.GND@1 93,75.75 93,75.25 50.25,75.25 49.75,74.75 49.75,68.5 52,66.25 54.75,66.25 54.75,44.25 57.25,44.25 57.5,44 57.5,41.78 S1.3
N$26  (1 unrouted)
N$27  (2 unrouted)
PA0  (2 unrouted)
PA1  (2 unrouted)
PA2  (2 unrouted)
PA3  (2 unrouted)
PA4  (2 unrouted)
PA5  (2 unrouted)
PA6  (2 unrouted)
PA7  (2 unrouted)
PB0  (1 unrouted)
PB1  (1 unrouted)
PB2  (1 unrouted)
PB3  (1 unrouted)
PC0  (1 unrouted)
PC1  (1 unrouted)
PC2  (1 unrouted)
PC3  (1 unrouted)
PC4  (1 unrouted)
PC5  (1 unrouted)
PC6  (1 unrouted)
PC7  (1 unrouted)
PE4  (1 unrouted)
PE5  (1 unrouted)
PG0  (1 unrouted)
PG1  (1 unrouted)
PG2  (1 unrouted)
PL0  (1 unrouted)
PL1  (2 unrouted)
PL2  (2 unrouted)
PL3  (2 unrouted)
PL4  (2 unrouted)
PL6  (1 unrouted)
RXD1  (2 unrouted)
RXD2  (2 unrouted)
TXD1  (1 unrouted)
TXD2  (1 unrouted)
VIN
  Bottom 0.406: POWER.8 57.74,50.76 57.75,50.75 54.75,50.75 S1.2

### Text on the board
tPlace: DB5 | DB7 | K | JP-LCD | GND | +5V | V0 | RS | R/W | E | DB4 | DB6 | A | BUTTON1 | BUTTON4 | 3FTH9 | 3FTH9 | BUTTON2 | VIN | BUTTON3 | LCD | 3FTH9 | 3FTH9 | HD44780 | GND | +5V | V0 | RS | R/W | E | GND | GND | 5V | RS | ADC3 | ADC2 | ADC2 | ADC1 | GND | GND | JP-LCD | DB4 | DB5 | DB6 | DB7 | A | K | PB0 | PB1 | PWR SW | PB2 | PB3 | DIGITAL | DIGITAL | PL0 | PL1 | PL2 | PL3 | PL4 | 128K x 8 | SRAM AS6C1008-55PCN | PL6 | PG0 | PG1 | PG2 | PC0 | PC1 | PC2 | PC3 | PC4 | PC5 | PC6 | PC7 | PA7 | PA6 | PA5 | PA4 | PA3 | PA2 | MEGACOMMAND 1.0.0c | PA1 | PA0 | PA0 | TXD1 | TXD2 | PE4 | PE5 | 5V | RXD1 | RXD2 | GND
bPlace: RXD1 | TXD1 | RXD2 | TXD2 | VIN | GND | Micro SD | 5V | 3V | GND | CLK | DO | DI | CS | CD